# EAGLE design V1 (EAGLE 9.6.2)
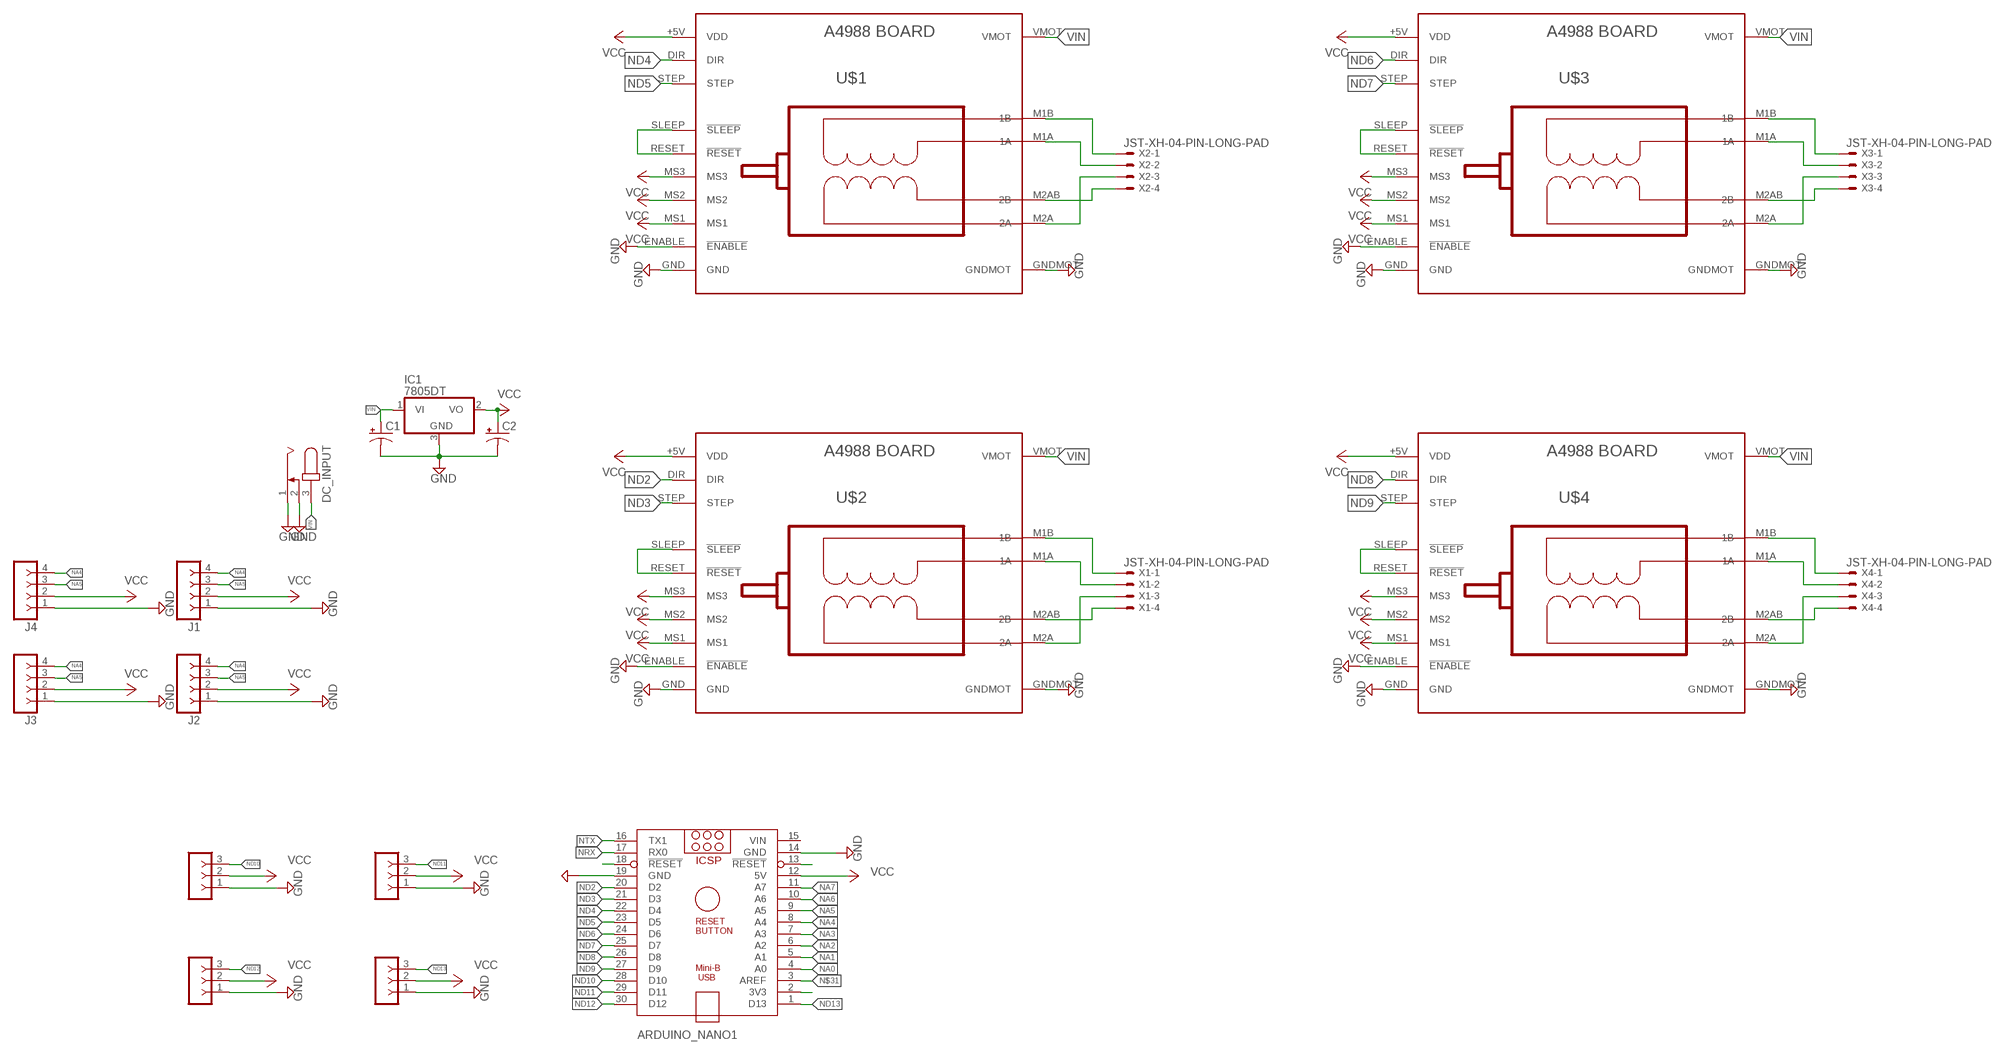
[diagram p0: schematic, sheet 1]

## Parts
ARDUINO_NANO1  ARDUINO_NANO  [ARDUINO_NANO]
C1  CPOL-USE2.5-5  [E2,5-5]
C2  CPOL-USE2.5-5  [E2,5-5]
DC_INPUT  JACK-PLUG0  [SPC4077]
IC1  7805DT  [TO252]
J1  F-1X04-SIP-100-40  [SIP-100-04-40]
J2  F-1X04-SIP-100-40  [SIP-100-04-40]
J3  F-1X04-SIP-100-40  [SIP-100-04-40]
J4  F-1X04-SIP-100-40  [SIP-100-04-40]
SERVO1  F-1X03-SIP-100-40  [SIP-100-03-40]
SERVO2  F-1X03-SIP-100-40  [SIP-100-03-40]
SERVO3  F-1X03-SIP-100-40  [SIP-100-03-40]
SERVO4  F-1X03-SIP-100-40  [SIP-100-03-40]
U$1  BOARD_A4988  [BOARD_A4988]
U$2  BOARD_A4988  [BOARD_A4988]
U$3  BOARD_A4988  [BOARD_A4988]
U$4  BOARD_A4988  [BOARD_A4988]
X1  JST-XH-04-PIN-LONG-PAD  [JST-XH-04-PACKAGE-LONG-PAD]
X2  JST-XH-04-PIN-LONG-PAD  [JST-XH-04-PACKAGE-LONG-PAD]
X3  JST-XH-04-PIN-LONG-PAD  [JST-XH-04-PACKAGE-LONG-PAD]
X4  JST-XH-04-PIN-LONG-PAD  [JST-XH-04-PACKAGE-LONG-PAD]

## Nets
GND: ARDUINO_NANO1.14(GND) ARDUINO_NANO1.19(GND) C1.- C2.- DC_INPUT.1 DC_INPUT.2 IC1.3(GND) J1.1 J2.1 J3.1 J4.1 SERVO1.1 SERVO2.1 SERVO3.1 SERVO4.1 U$1.ENABLE(!ENABLE) U$1.GND U$1.GNDMOT U$2.ENABLE(!ENABLE) U$2.GND U$2.GNDMOT U$3.ENABLE(!ENABLE) U$3.GND U$3.GNDMOT U$4.ENABLE(!ENABLE) U$4.GND U$4.GNDMOT
N$1: U$2.M1B(1B) X1.1
N$2: U$2.M1A(1A) X1.2
N$3: ARDUINO_NANO1.18(!RESET)
N$5: U$2.M2A(2A) X1.3
N$6: U$2.M2AB(2B) X1.4
N$7: U$1.M1B(1B) X2.1
N$8: U$1.M1A(1A) X2.2
N$9: U$1.M2A(2A) X2.3
N$10: U$1.M2AB(2B) X2.4
N$11: U$2.RESET(!RESET) U$2.SLEEP(!SLEEP)
N$12: U$1.RESET(!RESET) U$1.SLEEP(!SLEEP)
N$13: U$3.M1B(1B) X3.1
N$14: U$3.M1A(1A) X3.2
N$15: U$3.M2A(2A) X3.3
N$16: U$3.M2AB(2B) X3.4
N$17: U$3.RESET(!RESET) U$3.SLEEP(!SLEEP)
N$18: U$4.M1B(1B) X4.1
N$19: U$4.M1A(1A) X4.2
N$20: U$4.M2A(2A) X4.3
N$21: ARDUINO_NANO1.13(!RESET)
N$22: U$4.M2AB(2B) X4.4
N$23: U$4.RESET(!RESET) U$4.SLEEP(!SLEEP)
N$31: ARDUINO_NANO1.3(AREF)
N$32: ARDUINO_NANO1.2(3V3)
NA0: ARDUINO_NANO1.4(A0)
NA1: ARDUINO_NANO1.5(A1)
NA2: ARDUINO_NANO1.6(A2)
NA3: ARDUINO_NANO1.7(A3)
NA4: ARDUINO_NANO1.8(A4) J1.4 J2.4 J3.4 J4.4
NA5: ARDUINO_NANO1.9(A5) J1.3 J2.3 J3.3 J4.3
NA6: ARDUINO_NANO1.10(A6)
NA7: ARDUINO_NANO1.11(A7)
ND2: ARDUINO_NANO1.20(D2) U$2.DIR
ND3: ARDUINO_NANO1.21(D3) U$2.STEP
ND4: ARDUINO_NANO1.22(D4) U$1.DIR
ND5: ARDUINO_NANO1.23(D5) U$1.STEP
ND6: ARDUINO_NANO1.24(D6) U$3.DIR
ND7: ARDUINO_NANO1.25(D7) U$3.STEP
ND8: ARDUINO_NANO1.26(D8) U$4.DIR
ND9: ARDUINO_NANO1.27(D9) U$4.STEP
ND10: ARDUINO_NANO1.28(D10) SERVO1.3
ND11: ARDUINO_NANO1.29(D11) SERVO2.3
ND12: ARDUINO_NANO1.30(D12) SERVO3.3
ND13: ARDUINO_NANO1.1(D13) SERVO4.3
NRX: ARDUINO_NANO1.17(RX0)
NTX: ARDUINO_NANO1.16(TX1)
VCC: ARDUINO_NANO1.12(5V) C2.+ IC1.2(VO) J1.2 J2.2 J3.2 J4.2 SERVO1.2 SERVO2.2 SERVO3.2 SERVO4.2 U$1.+5V(VDD) U$1.MS1 U$1.MS2 U$1.MS3 U$2.+5V(VDD) U$2.MS1 U$2.MS2 U$2.MS3 U$3.+5V(VDD) U$3.MS1 U$3.MS2 U$3.MS3 U$4.+5V(VDD) U$4.MS1 U$4.MS2 U$4.MS3
VIN: C1.+ DC_INPUT.3 IC1.1(VI) U$1.VMOT U$2.VMOT U$3.VMOT U$4.VMOT

## Power pins joined to a net without a drawn wire
VIN: ARDUINO_NANO1.15(VIN)

## Library data of the parts
ARDUINO_NANO1 = ArduinoNanoV30:ARDUINO_NANO: Arduino Nano V3.0 Overview: The Arduino Nano is a small, complete, and breadboard-friendly board based on the ATmega328 (Arduino Nano 3.x) or ATmega168 (Arduino Nano 2.x). It has more or less the same functionality of the Arduino Duemilanove, but in a different package. It lacks only a DC power jack, and works with a Mini-B USB cable instead of a standard one. The Nano was designed and is being produced by Gravitech. Specifications: Microcontroller Atmel ATmega168 or ATmega328 Operating Voltage (logic level) 5 V Input Voltage (recommended) 7-12 V Input Voltage (limits) 6-20 V Digital I/O Pins 14 (of which 6 provide PWM output) Analog Input Pins 8 DC Current per I/O Pin 40 mA Flash Memory 16 KB (ATmega168) or 32 KB (ATmega328) of which 2 KB used by bootloader SRAM 1 KB (ATmega168) or 2 KB (ATmega328) EEPROM 512 bytes (ATmega168) or 1 KB (ATmega328) Clock Speed 16 MHz Dimensions 0.73" x 1.70" Length 45 mm Width 18 mm Weigth 5 g Power: The Arduino Nano can be powered via the Mini-B USB connection, 6-20V unregulated external power supply (pin 30), or 5V regulated external power supply (pin 27). The power source is automatically selected to the highest voltage source. Memory: The ATmega168 has 16 KB of flash memory for storing code (of which 2 KB is used for the bootloader); the ATmega328 has 32 KB, (also with 2 KB used for the bootloader). The ATmega168 has 1 KB of SRAM and 512 bytes of EEPROM (which can be read and written with the EEPROM library); the ATmega328 has 2 KB of SRAM and 1 KB of EEPROM. Input and Output: Each of the 14 digital pins on the Nano can be used as an input or output, using pinMode(), digitalWrite(), and digitalRead() functions. They operate at 5 volts. Each pin can provide or receive a maximum of 40 mA and has an internal pull-up resistor (disconnected by default) of 20-50 kOhms. In addition, some pins have specialized functions. Visit Arduino - ArduinoBoardNano <https://www.arduino.cc/en/Main/ArduinoBoardNano>
C1 C2 = rcl:CPOL-US: POLARIZED CAPACITOR, American symbol; SPICEPREFIX: C
DC_INPUT = con-jack:JACK-PLUG: DC POWER JACK Power Jack, DC, Right Angle, Through Hole, Rated 5A at 16VDC, PC Terminals Distributor: Farnell (www.Farnell.de) Drawing: 84N1161.pdf / 84N1162.pdf Manufacturer: SPC Technology (www.spctechnology.com) Type: SPC4077 / SPC 4078
IC1 = linear:78*: Positive VOLTAGE REGULATOR Source: http://cache.national.com/ds/LM/LM78L05.pdf http://www.fairchildsemi.com/ds/LM/LM7805.pdf
J1-J4 = con-headers-jp:F-1X04-: FEMALE HEADER
SERVO1-SERVO4 = con-headers-jp:F-1X03-: FEMALE HEADER
U$1-U$4 = Stepper driver:BOARD_A4988
X1-X4 = JSt:JST-XH-04-PIN: JST XH Connector 2 Pin Wire to board connector. Pitch: 2,54 mm, (0.100") Number of pins: 4 Created by Rembrandt Electronics www.rembrandtelectronics.com

## Board
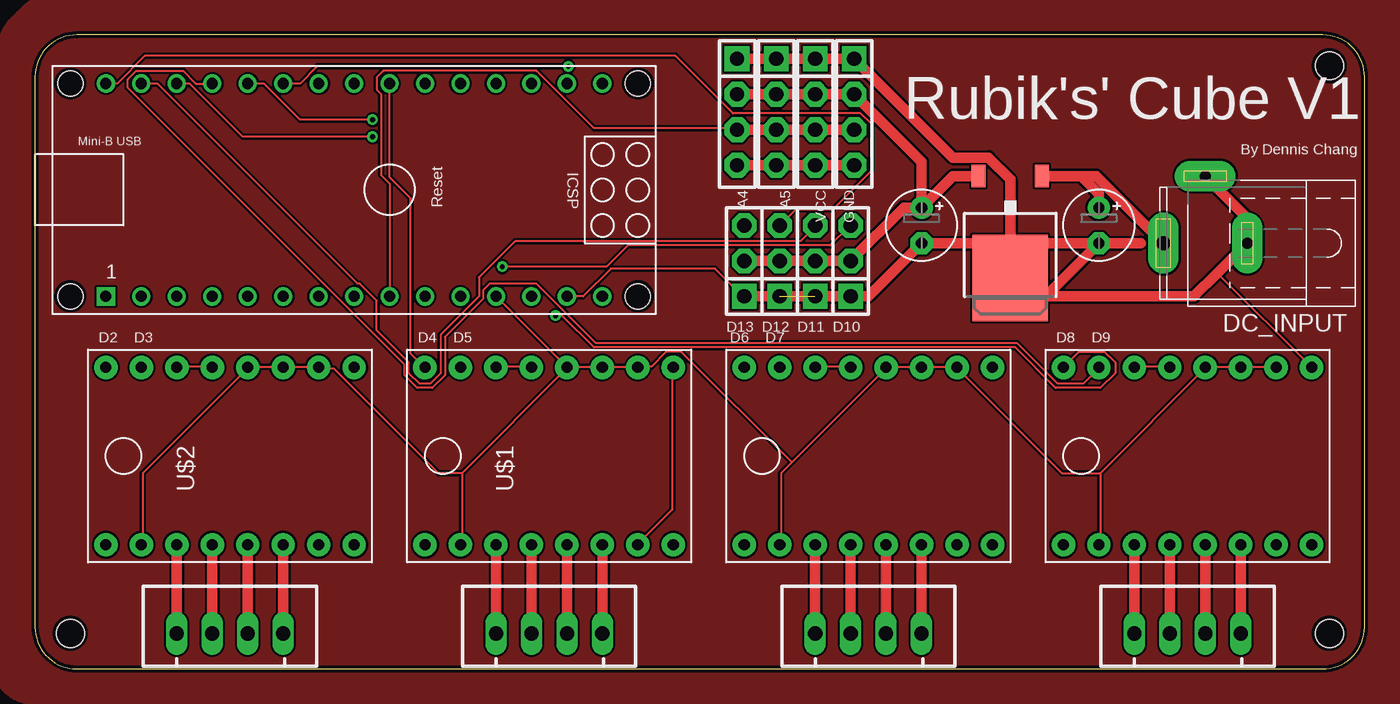
[diagram p1: board, top side]
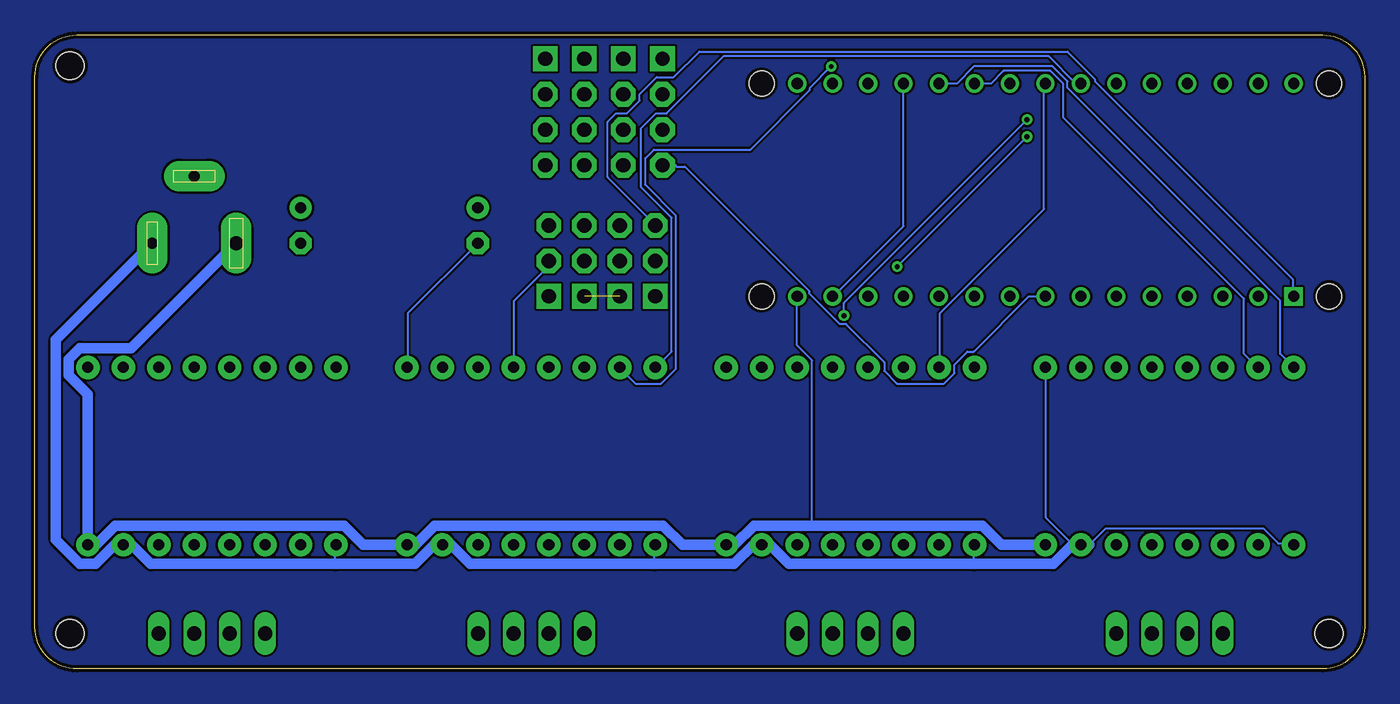
[diagram p2: board, bottom side, seen from below]

Size 95.23 x 45.39 mm. Coordinates in mm from the lower left corner, seen from the top.
Outline: 80.32,28.73 80.32,32.23 81.32,32.23 81.32,28.73 80.32,28.73
Outline: 86.42,28.98 86.42,31.98 87.22,31.98 87.22,28.98 86.42,28.98
Outline: 82.32,34.88 82.32,35.68 85.32,35.68 85.32,34.88 82.32,34.88
Outline: 0,42.39 0,3 arc90 3,0 92.23,0 92.49,0.01 arc85 95.23,3 95.23,42.39 95.22,42.65 arc85 92.23,45.39 3,45.39 2.74,45.38 arc85 0,42.39
Copper layers (1*16): Top 0.035mm / dielectric 1.5mm / Bottom 0.035mm
Design rules "default *": minimum track width 6mil, minimum drill 0.35mm, track to track 6mil, track to pad 6mil, pad to pad 6mil, via to via 6mil, smd to smd 6mil, copper to edge 10mil, drill to drill 6mil, minimum pad ring 10mil, minimum via ring 8mil, stop-mask expansion 4mil, vias tented up to drill 3mm, thermal gap 10mil
Holes 2 mm at 2.54,2.54 92.71,2.54 92.71,43.18
Holes 1.78 mm at 2.54,26.67 2.54,41.91 43.18,41.91 43.18,26.67

### Footprints (pad centres in the part's own frame; a part is rotated, then mirrored left to right if it is on the bottom)
ARDUINO_NANO = drill 0.8 square: 1 -20.32,-7.62 | drill 0.8: 2 -17.78,-7.62; 3 -15.24,-7.62; 4 -12.7,-7.62; 5 -10.16,-7.62; 6 -7.62,-7.62; 7 -5.08,-7.62; 8 -2.54,-7.62; 9 0,-7.62; 10 2.54,-7.62; 11 5.08,-7.62; 12 7.62,-7.62; 13 10.16,-7.62; 14 12.7,-7.62; 15 15.24,-7.62; 16 15.24,7.62; 17 12.7,7.62; 18 10.16,7.62; 19 7.62,7.62; 20 5.08,7.62; 21 2.54,7.62; 22 0,7.62; 23 -2.54,7.62; 24 -5.08,7.62; 25 -7.62,7.62; 26 -10.16,7.62; 27 -12.7,7.62; 28 -15.24,7.62; 29 -17.78,7.62; 30 -20.32,7.62 | hole 1.778: -22.86,-7.62; -22.86,7.62; 17.78,7.62; 17.78,-7.62
E2,5-5 = drill 0.813 pad 1.6: + -1.27,0 | drill 0.813 pad 1.6 octagon: - 1.27,0
SPC4077 = drill 0.8 pad 2.184 long: 1 -3,0; 2 0,-4.8 | drill 1 pad 2.184 long: 3 3,0
TO252 = smd 1 x 1.6: 1 -2.28,-4.8; 2 2.28,-4.8 | smd 5.4 x 6.2: 3 0,2.5
SIP-100-04-40 = drill 1.016 pad 1.778 square: 1 -3.81,0 | drill 1.016 pad 1.778 octagon: 2 -1.27,0; 3 1.27,0; 4 3.81,0
SIP-100-03-40 = drill 1.016 pad 1.778 square: 1 -2.54,0 | drill 1.016 pad 1.778 octagon: 2 0,0; 3 2.54,0
BOARD_A4988 = drill 0.8 pad 1.676: +5V 1.27,16.51; DIR 13.97,19.05; ENABLE 13.97,1.27; GND 1.27,19.05; GNDMOT 1.27,3.81; M1A 1.27,11.43; M1B 1.27,13.97; M2A 1.27,8.89; M2AB 1.27,6.35; MS1 13.97,3.81; MS2 13.97,6.35; MS3 13.97,8.89; RESET 13.97,11.43; SLEEP 13.97,13.97; STEP 13.97,16.51; VMOT 1.27,1.27
JST-XH-04-PACKAGE-LONG-PAD = drill 1.016 long: 1 -3.81,0; 2 -1.27,0; 3 1.27,0; 4 3.81,0

### Placement (x,y rotation side)
ARDUINO_NANO1  25.4,34.29 0 top
C1  76.2,31.75 270 top
C2  63.5,31.75 270 top
DC_INPUT  83.82,30.48 180 top
IC1  69.85,30.48 180 top
J1  58.67,39.88 270 top
J2  55.88,39.88 270 top
J3  53.09,39.88 270 top
J4  50.29,39.88 270 top
SERVO1  58.42,29.21 90 top
SERVO2  55.88,29.21 90 top
SERVO3  53.34,29.21 90 top
SERVO4  50.8,29.21 90 top
U$1  46.99,7.62 90 top
U$2  24.13,7.62 90 top
U$3  69.85,7.62 90 top
U$4  92.71,7.62 90 top
X1  13.97,2.54 0 top
X2  36.83,2.54 0 top
X3  59.69,2.54 0 top
X4  82.55,2.54 0 top

### Tracks (layer width: path | path; a pad name or v marks a point on that pad's centre or on a via)
GND  (1 unrouted)
  Top 0.152: U$1.ENABLE 45.67,21.49 45.67,11.43 43.23,8.99 U$1.GNDMOT | 84.69,28.34 U$4.ENABLE | IC1.3 69.9,28.04 69.83,27.96 | J3.1 53.19,43.74 53.19,43.69 | 55.78,43.69 55.78,43.74 J2.1 | ARDUINO_NANO1.14 39.27,26.67 41.25,28.65 48.72,28.65 50.55,26.82 SERVO4.1
  Top 0.762: 72.39,26.67 83.01,26.67 84.69,28.34 DC_INPUT.1 86.82,32.28 DC_INPUT.2 | SERVO4.1 SERVO3.1 SERVO1.1 59.69,26.67 C2.- 67.31,30.48 69.83,27.96 71.12,26.67 72.39,26.67 | C1.- 72.39,26.67 | J4.1 J3.1 53.19,43.69 55.78,43.69 J2.1 J1.1 65.75,36.61 68.29,36.61 69.85,35.05 69.85,30.48 C1.- | C1.- 79.19,30.48
  Bottom 0.152: U$2.GND 5.13,8.99 6.2,8.99 7.26,10.06 18.54,10.06 19.46,9.14 19.72,8.89 | 27.99,7.52 27.99,8.84 U$1.GND | 50.85,7.52 50.85,8.84 U$3.GND | 73.71,7.52 73.71,8.84 U$4.GND | C2.- 68.53,25.45 68.53,21.64 U$3.ENABLE | ARDUINO_NANO1.19 33.02,31.7 38.05,26.67 ARDUINO_NANO1.14 | U$2.ENABLE 22.81,21.49 22.81,10.82 21.13,9.14 U$2.GNDMOT
  Bottom 0.762: DC_INPUT.1 93.73,23.57 93.73,9.24 92.01,7.52 90.87,7.52 89.5,8.89 U$4.GNDMOT 88.3,8.89 86.93,7.52 73.71,7.52 68.01,7.52 66.64,8.89 U$3.GNDMOT 65.44,8.89 64.07,7.52 50.85,7.52 45.15,7.52 43.78,8.89 U$1.GNDMOT 42.58,8.89 41.21,7.52 27.99,7.52 22.29,7.52 20.92,8.89 U$2.GNDMOT 19.72,8.89
N$1
  Top 0.762: U$2.M1B X1.1
N$2
  Top 0.762: U$2.M1A X1.2
N$4
  pour Top: -2.54,-1.27 -2.54,44.48 arc-45 -1.66,46.6 -1.27,46.99 -0.88,47.38 arc-45 1.24,48.26 97.79,48.26 97.79,-2.54 -0.03,-2.54 arc-45 -2.15,-1.66
N$5
  Top 0.762: U$2.M2A X1.3
N$6
  Top 0.762: U$2.M2AB X1.4
N$7
  Top 0.762: U$1.M1B X2.1
N$8
  Top 0.762: U$1.M1A X2.2
N$9
  Top 0.762: U$1.M2A X2.3
N$10
  Top 0.762: U$1.M2AB X2.4
N$11
  Top 0.152: U$2.SLEEP 10.16,21.64 12.6,21.64 U$2.RESET
N$12
  Top 0.152: U$1.SLEEP 33.02,21.64 35.46,21.64 U$1.RESET
N$13
  Top 0.762: U$3.M1B X3.1
N$14
  Top 0.762: U$3.M1A X3.2
N$15
  Top 0.762: U$3.M2A X3.3
N$16
  Top 0.762: U$3.M2AB X3.4
N$17
  Top 0.152: U$3.SLEEP 55.88,21.64 58.32,21.64 U$3.RESET
N$18
  Top 0.762: U$4.M1B X4.1
N$19
  Top 0.762: U$4.M1A X4.2
N$20
  Top 0.762: U$4.M2A X4.3
N$22
  Top 0.762: U$4.M2AB X4.4
N$23
  Top 0.152: U$4.SLEEP 78.74,21.64 81.18,21.64 U$4.RESET
N$24
  pour Bottom: -7.62,53.34 -7.62,-14 arc45 -6.74,-16.12 -5.08,-17.78 99.09,-17.78 arc45 101.21,-16.9 115.57,-2.54 115.57,43.21 arc45 114.69,45.33 101.6,58.42 -1.3,58.42 arc45 -3.42,57.54
NA4
  Top 0.152: J3.4 53.19,36.12 53.19,36.07 | J2.4 55.93,36.12 55.93,36.07
  Top 0.762: J1.4 55.93,36.07 J2.4 53.19,36.07 J3.4 J4.4
  Bottom 0.152: ARDUINO_NANO1.8 24.03,26.67 27.99,22.71 28.45,22.71 29.36,21.79 29.36,21.18 30.12,20.42 33.48,20.42 34.39,21.34 34.39,21.95 37.13,24.69 37.59,24.69 39.76,26.85 39.76,27.04 48.69,35.97 49.33,35.97 49.33,36.07 J4.4
NA5
  Top 0.152: ARDUINO_NANO1.9 25.4,34.75 24.79,35.36 24.79,41.15 24.49,41.45 24.49,42.37 24.94,42.82 35.92,42.82 40.03,38.71 49.99,38.71 J4.3 | J3.3 53.19,38.71 53.19,38.61 | J2.3 55.93,38.71 55.93,38.61
  Top 0.762: J1.3 55.93,38.61 J2.3 53.19,38.61 J3.3 J4.3
ND2
  Bottom 0.152: ARDUINO_NANO1.20 29.21,41.91 27.99,43.13 22.35,43.13 21.29,42.06 21.29,41.6 6.04,26.36 6.04,22.55 U$2.DIR
ND3
  Bottom 0.152: ARDUINO_NANO1.21 26.77,41.91 25.86,42.82 22.5,42.82 21.59,41.91 21.59,39.47 8.64,26.52 8.64,22.55 7.72,21.64 U$2.STEP
ND4
  Top 0.152: ARDUINO_NANO1.22 25.4,35.2 26.92,33.68 26.92,22.55 27.84,21.64 U$1.DIR
ND5
  Bottom 0.152: ARDUINO_NANO1.23 22.96,41.91 22.96,32.92 30.43,25.45 30.43,21.64 U$1.STEP
ND6
  Bottom 0.152: ARDUINO_NANO1.24 20.68,41.91 22.66,43.89 45.87,43.89 49.99,39.78 50.75,39.78 51.82,38.71 51.82,34.49 49.63,32.31 49.63,22.71 50.7,21.64 U$3.DIR
ND7  (via drill 0.35)
  Top 0.152: ARDUINO_NANO1.25 19,41.91 20.22,43.13 v38.2,43.13
  Bottom 0.152: v38.2,43.13 39.73,41.6 39.73,41.45 43.99,37.19 50.9,37.19 51.51,36.58 51.51,34.65 49.33,32.46 49.33,21.49 50.39,20.42 52.22,20.42 53.29,21.49 U$3.STEP
ND8  (via drill 0.35)
  Top 0.152: ARDUINO_NANO1.26 16.41,41.91 19,39.32 v24.18,39.32 | v37.29,25.3 37.74,25.3 40.03,23.01 70.21,23.01 73.1,20.12 76.3,20.12 77.37,21.18 77.37,21.95 76.61,22.71 74.78,22.71 U$4.DIR
  Bottom 0.152: v24.18,39.32 37.29,26.21 v37.29,25.3
ND9
  Top 0.152: ARDUINO_NANO1.27 11.53,41.91 10.62,42.82 7.26,42.82 6.66,42.22 6.66,41.6 26.47,21.79 26.47,21.03 27.38,20.12 28.45,20.12 29.36,21.03 29.36,23.77 32.11,26.52 32.11,27.13 32.56,27.58 35.92,27.58 40.18,23.32 70.36,23.32 73.25,20.42 75.08,20.42 76.15,21.49 U$4.STEP
ND10  (via drill 0.35)
  Top 0.152: ARDUINO_NANO1.28 11.07,41.91 14.88,38.1 v24.18,38.1 | v33.48,28.8 40.95,28.8 42.47,30.33 56.95,30.33 58.32,31.7 SERVO1.3
  Bottom 0.152: v33.48,28.8 v24.18,38.1
ND11
  Top 0.152: ARDUINO_NANO1.29 8.79,41.91 23.11,27.58 23.27,27.58 24.49,26.36 24.49,24.23 26.77,21.95 26.77,21.18 27.53,20.42 28.3,20.42 29.06,21.18 29.06,23.93 31.8,26.67 31.8,28.04 34.39,30.63 54.81,30.63 55.88,31.7 SERVO2.3
ND12
  Top 0.152: ARDUINO_NANO1.30 5.89,41.91 7.87,43.89 45.87,43.89 49.99,39.78 59.13,39.78 59.89,39.01 59.89,35.66 57.15,32.92 54.51,32.92 SERVO3.3
ND13
  Bottom 0.152: ARDUINO_NANO1.1 5.13,26.67 5.13,27.89 19.3,42.06 19.3,42.22 21.29,44.2 47.65,44.2 49.48,42.37 50.7,42.37 51.92,41.15 51.92,40.69 52.83,39.78 53.59,39.78 54.2,39.17 54.2,35.2 50.85,31.85 SERVO4.3
VCC
  Top 0.152: U$2.+5V 7.72,8.99 7.72,14.02 15.19,21.49 U$2.MS3 15.34,21.64 17.78,21.64 | 17.78,21.64 20.22,21.64 U$2.MS1 20.37,21.49 21.44,21.49 28.9,14.02 30.58,14.02 | 17.78,21.64 U$2.MS2 | 40.64,21.64 38.2,21.64 U$1.MS3 | 40.64,21.64 43.08,21.64 U$1.MS1 43.23,21.64 44.14,21.64 45.21,22.71 46.28,22.71 54.2,14.78 | 40.64,21.64 U$1.MS2 | 76.3,14.02 76.3,8.99 U$4.+5V | 76.3,14.02 83.77,21.49 U$4.MS3 83.92,21.64 86.36,21.64 | 86.36,21.64 88.8,21.64 U$4.MS1 | 86.36,21.64 U$4.MS2 | SERVO3.2 53.44,29.26 53.44,29.21 | 55.88,29.26 SERVO2.2 | 54.2,14.78 60.91,21.49 U$3.MS3 61.06,21.64 63.5,21.64 | 54.2,14.78 53.44,14.02 53.44,8.99 U$3.+5V | 63.5,21.64 65.94,21.64 U$3.MS1 66.09,21.49 73.56,14.02 76.3,14.02 | 63.5,21.64 U$3.MS2 | U$1.MS3 ARDUINO_NANO1.12 | 30.58,14.02 30.58,8.99 U$1.+5V | 30.58,14.02 38.05,21.49 U$1.MS3
  Top 0.762: IC1.2 65.76,35.28 C2.+ | SERVO4.2 SERVO3.2 53.44,29.21 SERVO2.2 SERVO1.2 62.23,33.02 C2.+ | J4.2 J3.2 J2.2 J1.2 63.5,36.32 C2.+
  Bottom 0.152: SERVO1.2 58.47,29.11 58.47,28.8 60.91,26.36 60.91,21.64 U$3.MS3
VIN
  Top 0.762: DC_INPUT.3 76.02,35.28 74.93,35.28 | 74.93,35.28 IC1.1 | C1.+ 76.2,34.01 74.93,35.28
  Bottom 0.152: ARDUINO_NANO1.15 40.64,23.16 39.57,22.1 39.57,10.26
  Bottom 0.762: U$2.VMOT 26,8.89 27.37,10.26 39.57,10.26 43.75,10.26 45.12,8.89 U$1.VMOT 48.86,8.89 50.23,10.26 66.61,10.26 67.98,8.89 U$3.VMOT 71.72,8.89 73.09,10.26 89.47,10.26 90.84,8.89 U$4.VMOT 91.44,19.65 92.81,21.02 92.81,22.16 92.01,22.96 88.34,22.96 DC_INPUT.3

### Text on the board
tPlace: Rubik's' Cube V1 | By Dennis Chang | A4 | A5 | VCC | GND | D13 | D12 | D11 | D10 | D2 | D3 | D4 | D5 | D6 | D7 | D8 | D9